# EAGLE design glass_udrive_pcb (EAGLE 7.7.0)
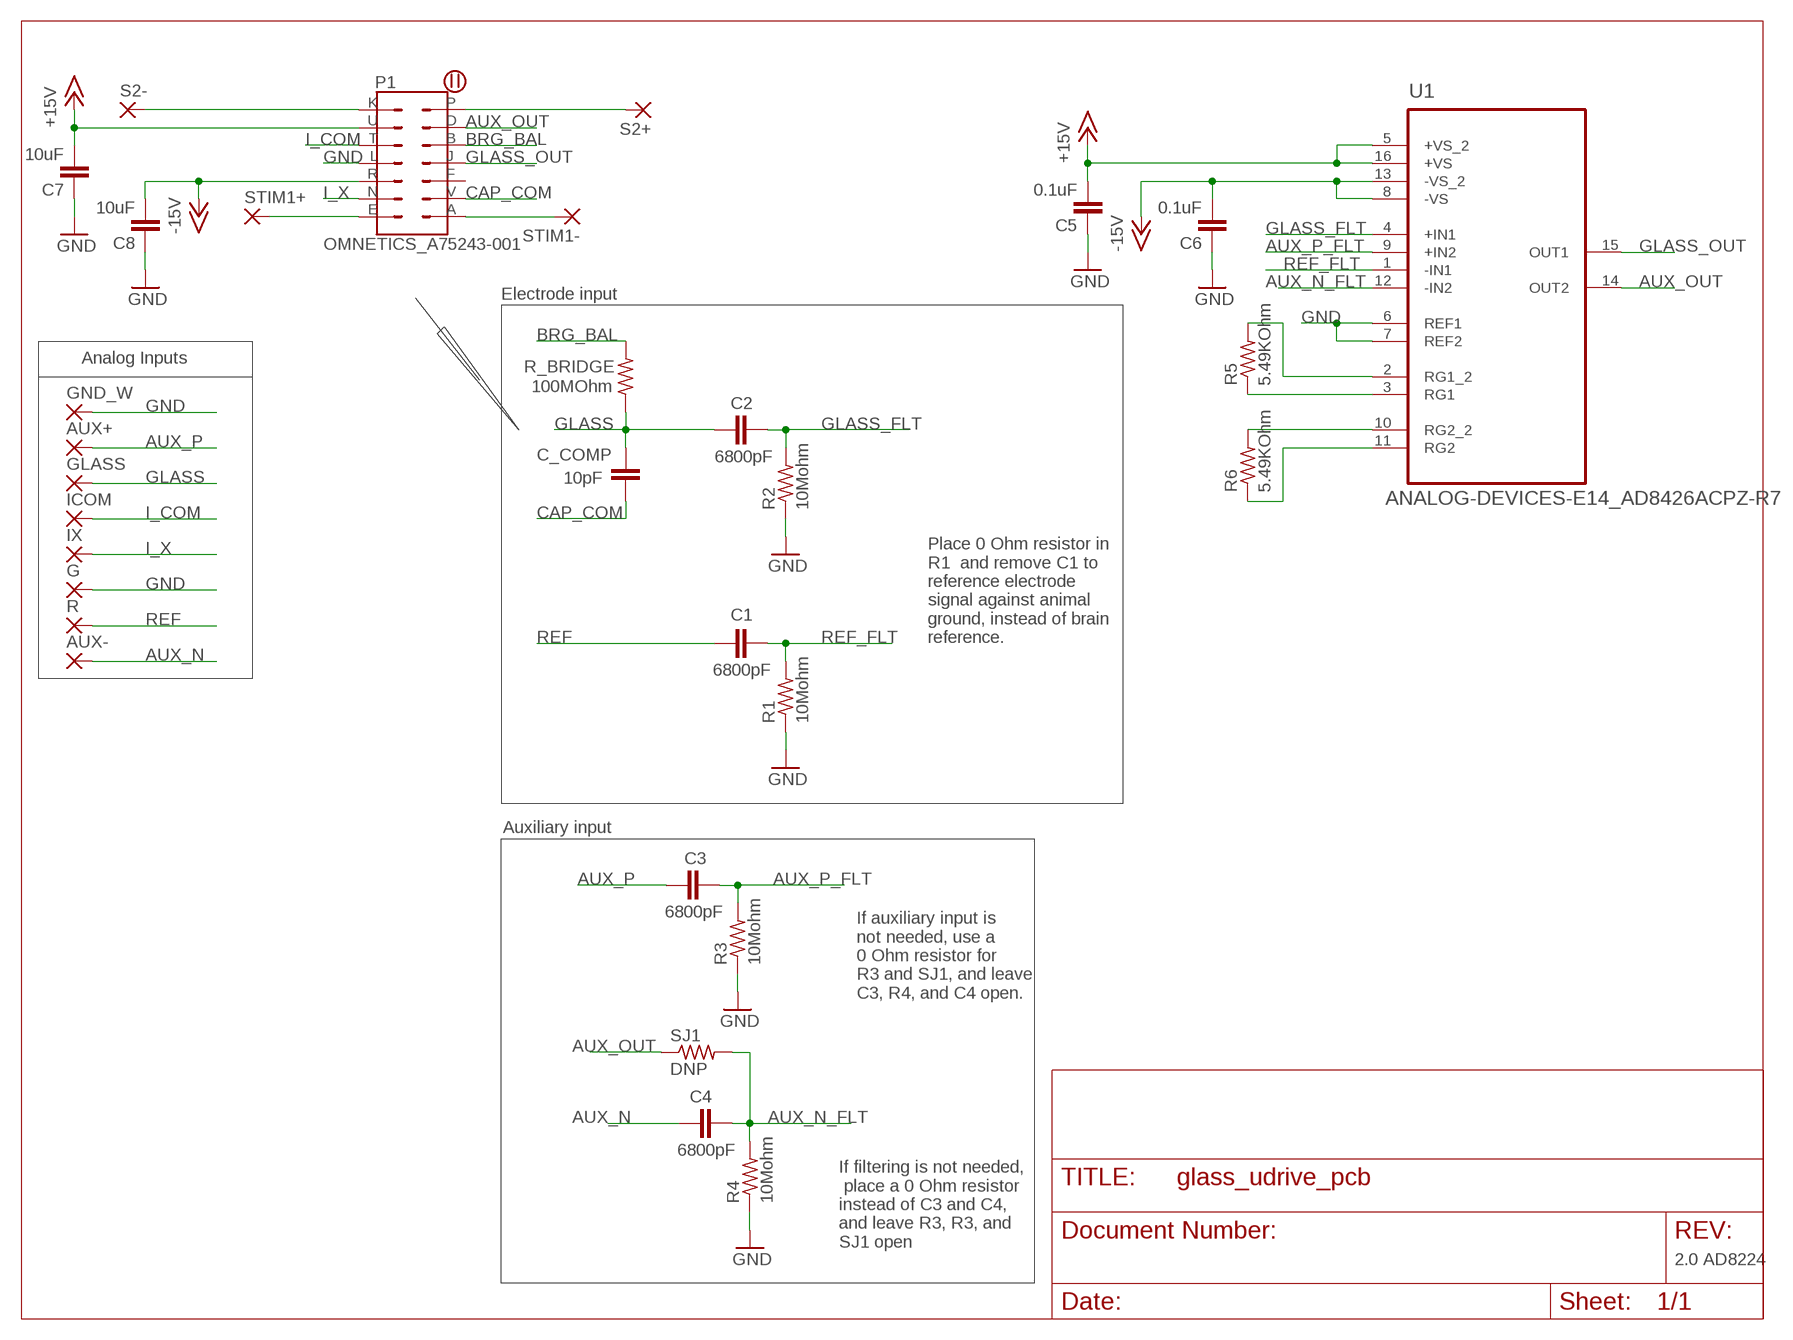
[diagram p0: schematic, sheet 1]

## Parts
AUX+  THROUGH-HOLE-30MIL/15MIL  [30MIL/15MIL]
AUX-  THROUGH-HOLE-30MIL/15MIL  [30MIL/15MIL]
C1  6800pF  C_0201  [0201]
C2  6800pF  C_0201  [0201]
C3  6800pF  C_0201  [0201]
C4  6800pF  C_0201  [0201]
C5  0.1uF  C_0201  [0201]
C6  0.1uF  C_0201  [0201]
C7  10uF  C_0603  [0603]
C8  10uF  C_0603  [0603]
C_COMP  10pF  C_0402  [0402]
G  THROUGH-HOLE-30MIL/15MIL  [30MIL/15MIL]
GLASS  THROUGH-HOLE-30MIL/15MIL  [30MIL/15MIL]
GND_W  THROUGH-HOLE-30MIL/15MIL  [30MIL/15MIL]
ICOM  THROUGH-HOLE-30MIL/15MIL  [30MIL/15MIL]
IX  THROUGH-HOLE-30MIL/15MIL  [30MIL/15MIL]
P1  OMNETICS_A75243-001  [OMNETICS_A75243-001]
R  THROUGH-HOLE-30MIL/15MIL  [30MIL/15MIL]
R1  10Mohm  R_0201  [0201]
R2  10Mohm  R_0201  [0201]
R3  10Mohm  R_0201  [0201]
R4  10Mohm  R_0201  [0201]
R5  5.49KOhm  R_0201  [0201]
R6  5.49KOhm  R_0201  [0201]
R_BRIDGE  100MOhm  R_0402  [0402]
S2+  THROUGH-HOLE-30MIL/15MIL  [30MIL/15MIL]
S2-  THROUGH-HOLE-30MIL/15MIL  [30MIL/15MIL]
SJ1  DNP  R_0201  [0201]
STIM1+  THROUGH-HOLE-30MIL/15MIL  [30MIL/15MIL]
STIM1-  THROUGH-HOLE-30MIL/15MIL  [30MIL/15MIL]
U1  ANALOG-DEVICES-E14_AD8426ACPZ-R7  [ANALOG-DEVICES-E14_QFN65P400X400X100-16N]

## Nets
+15V: C5.2 C7.2 P1.U U1.5(+VS_2) U1.16(+VS)
-15V: C6.2 C8.2 P1.R U1.8(-VS) U1.13(-VS_2)
AUX_N: AUX-.P$1(P) C4.1
AUX_N_FLT: C4.2 R4.2 SJ1.2 U1.12(-IN2)
AUX_OUT: P1.D SJ1.1 U1.14(OUT2)
AUX_P: AUX+.P$1(P) C3.1
AUX_P_FLT: C3.2 R3.2 U1.9(+IN2)
BRG_BAL: P1.B R_BRIDGE.2
CAP_COM: C_COMP.2 P1.V
GLASS: C2.1 C_COMP.1 GLASS.P$1(P) R_BRIDGE.1
GLASS_FLT: C2.2 R2.2 U1.4(+IN1)
GLASS_OUT: P1.J U1.15(OUT1)
GND: C5.1 C6.1 C7.1 C8.1 G.P$1(P) GND_W.P$1(P) P1.L R1.1 R2.1 R3.1 R4.1 U1.6(REF1) U1.7(REF2)
I_COM: ICOM.P$1(P) P1.T
I_X: IX.P$1(P) P1.N
N$2: R5.2 U1.2(RG1_2)
N$4: R5.1 U1.3(RG1)
N$6: R6.2 U1.10(RG2_2)
N$7: R6.1 U1.11(RG2)
REF: C1.1 R.P$1(P)
REF_FLT: C1.2 R1.2 U1.1(-IN1)
STIM1_N: P1.A STIM1-.P$1(P)
STIM1_P: P1.E STIM1+.P$1(P)
STIM2_N: P1.P S2+.P$1(P)
STIM2_P: P1.K S2-.P$1(P)
Unconnected: P1.F

## Notes on the sheet
- Electrode input
- Analog Inputs
- Place 0 Ohm resistor in 
  R1  and remove C1 to 
  reference electrode 
  signal against animal
  ground, instead of brain
  reference.
- Auxiliary input
- If auxiliary input is
  not needed, use a
  0 Ohm resistor for
  R3 and SJ1, and leave
  C3, R4, and C4 open.
- If filtering is not needed,
   place a 0 Ohm resistor 
  instead of C3 and C4, 
  and leave R3, R3, and 
  SJ1 open
- 2.0 AD8224

## Library data of the parts
AUX+ AUX- G GLASS GND_W ICOM IX R S2+ S2- STIM1+ STIM1- = GFL:THROUGH-HOLE-30MIL/15MIL: THROUGH-HOLE PAD
C1-C8 C_COMP = GFL:C: Capacitor
P1 = GFL:OMNETICS_A75243-001
R1-R6 R_BRIDGE SJ1 = GFL:R: Resistor
U1 = GyroDrive:ANALOG-DEVICES-E14_AD8426ACPZ-R7: Wide Supply Range, Rail-to-Rail Output Instrumentation Amplifier; MPN: AD8426ACPZ-R7; OC_FARNELL: 1971714; OC_NEWARK: 58T4523; PACKAGE: LFCSP-16; SUPPLIER: Analog Devices

## Board
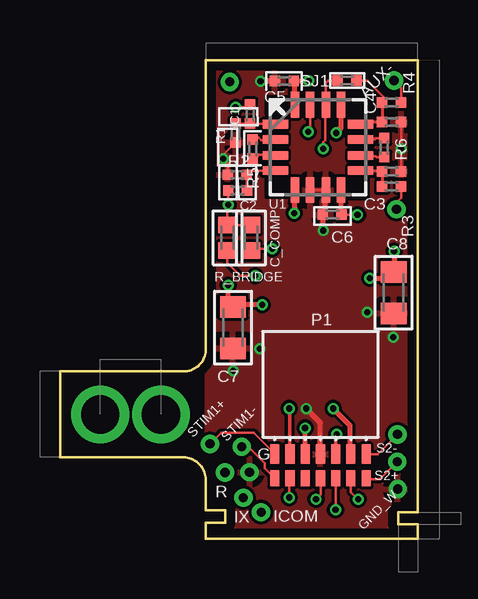
[diagram p1: board, top side]
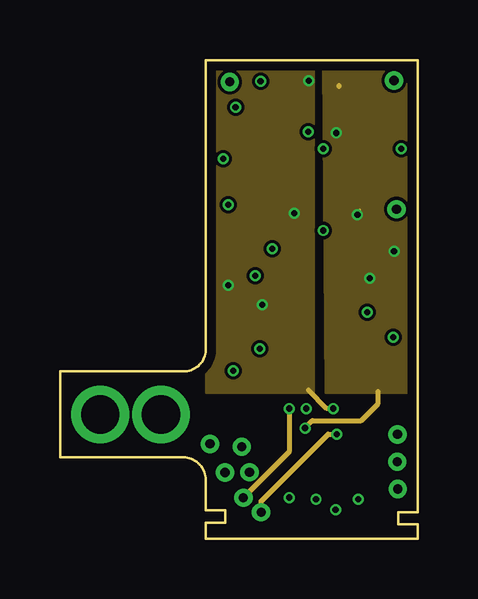
[diagram p2: board, inner layer Route2]
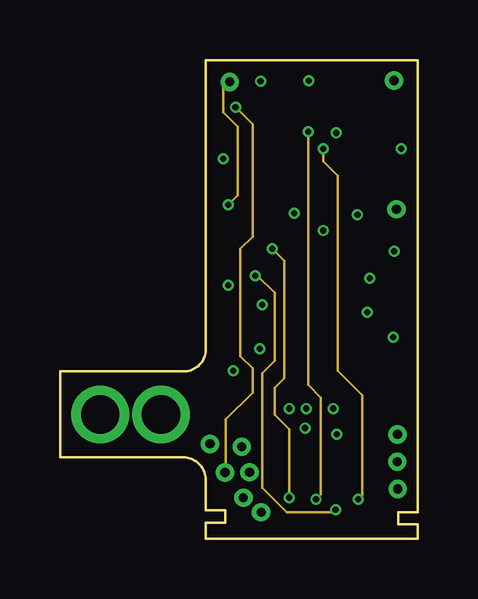
[diagram p3: board, inner layer Route15]
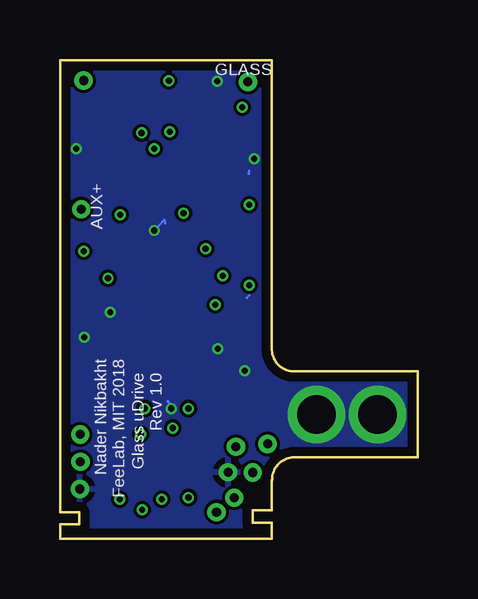
[diagram p4: board, bottom side, seen from below]

Size 14.9 x 19.95 mm. Coordinates in mm from the lower left corner, seen from the top.
Outline: 14.9,8.14 14.9,19.95 6.09,19.95
Outline: 6.07,0.68 6.07,0 14.9,0 14.9,0.6
Outline: 14.9,1.1 14.9,8.17
Outline: 6.07,2.46 arc90 5.13,3.4 0,3.4 0,6.98 5.13,6.98 arc90 6.07,7.86 6.07,19.95
Outline: 6.07,2.46 6.07,1.2
Outline: 6.08,1.2 6.88,1.2 6.88,0.68 6.08,0.68
Outline: 14.9,0.6 14.1,0.6 14.1,1.1 14.9,1.1
Copper layers (1*2*15*16): Top 0.035559375mm / dielectric 0.17018125mm / Route2 0.01778125mm / dielectric 47mil / Route15 0.01778125mm / dielectric 0.17018125mm / Bottom 0.035559375mm
Design rules "pcbway *": minimum track width 4mil, minimum drill 10mil, track to track 5mil, track to pad 5mil, pad to pad 5mil, via to via 5mil, smd to smd 5mil, copper to edge 15mil, drill to drill 6mil, minimum pad ring 4mil, minimum via ring 4mil, stop-mask expansion 2.5mil, vias tented up to drill 12mil, thermal gap 10mil
tRestrict: area 8.5,17.6 to 9.5,18.5; area 12,17.6 to 12.9,18.5; area 12,14.1 to 12.9,15; area 8.5,14.2 to 9.5,15

### Footprints (pad centres in the part's own frame; a part is rotated, then mirrored left to right if it is on the bottom)
30MIL/15MIL = drill 0.381 pad 0.762: P$1 0,0
0201 = smd 0.432 x 0.432: 1 -0.394,0; 2 0.394,0
0603 = smd 0.889 x 1.067: 1 -0.864,0; 2 0.864,0
0402 = smd 0.686 x 0.762: 1 -0.533,0; 2 0.533,0
OMNETICS_A75243-001 = smd 0.381 x 0.686: A -1.905,-0.47; B 0.635,-0.47; D 1.27,-0.47; F -0.635,-0.47; J 0,-0.47; P 1.905,-0.47; V -1.27,-0.47 | smd 0.381 x 0.813: E -1.905,0.533; K 1.905,0.533; L 0,0.533; N -1.27,0.533; R -0.635,0.533; T 0.635,0.533; U 1.27,0.533
ANALOG-DEVICES-E14_QFN65P400X400X100-16N = smd 1.067 x 0.356: 1 -1.778,0.965; 2 -1.778,0.33; 3 -1.778,-0.33; 4 -1.778,-0.965; 9 1.778,-0.965; 10 1.778,-0.33; 11 1.778,0.33; 12 1.778,0.965 | smd 0.356 x 1.067: 5 -0.965,-1.778; 6 -0.33,-1.778; 7 0.33,-1.778; 8 0.965,-1.778; 13 0.965,1.778; 14 0.33,1.778; 15 -0.33,1.778; 16 -0.965,1.778

### Placement (x,y rotation side)
AUX+  14.02,13.74 0 top
AUX-  13.92,19.1 0 top
C1  7.92,17.7 270 top
C2  7.41,14.51 0 top
C3  13.82,14.68 180 top
C4  13.82,18.18 180 top
C5  9.34,19.08 0 top
C6  11.34,13.51 0 top
C7  7.21,8.8 90 top
C8  13.9,10.26 90 top
C_COMP  7.96,12.54 270 top
G  7.9,2.77 0 top
GLASS  7.07,19.04 0 top
GND_W  14.07,2.08 0 top
ICOM  8.38,1.11 0 top
IX  7.64,1.71 0 top
P1  10.85,3 0 top
R  6.87,2.77 0 top
R1  7.31,16.91 90 top
R2  7.38,15.17 0 top
R3  13.82,15.31 180 top
R4  13.82,17.37 180 top
R5  8.03,16.25 90 top
R6  13.51,16.3 270 top
R_BRIDGE  6.98,12.54 270 top
S2+  14.05,3.21 0 top
S2-  14.06,4.35 0 top
SJ1  11.96,19.1 0 top
STIM1+  6.25,3.96 0 top
STIM1-  7.57,3.84 0 top
U1  10.75,16.31 0 top

### Tracks (layer width: path | path; a pad name or v marks a point on that pad's centre or on a via)
+15V  (via drill 0.25)
  Top 0.203: P1.U 12.09,3.56 12.09,4.72 v11.38,5.43 | v9.76,13.56 9.78,13.79 U1.5 | C7.2 7.01,9.86 v7.01,10.56 | v10.36,19.1 10.35,19.08 C5.2 9.78,19.04 U1.16 | v8.43,9.75 7.21,9.75
  Route2 0.203: v11.38,5.43 11.12,5.43 10.36,6.19 | v10.36,19.1 10.46,19.1
  pour Route2: 6.1,19.91 10.57,19.91 10.57,6.09 6.1,6.09
-15V  (via drill 0.25)
  Top 0.102: v12.39,13.51 C6.2 11.71,13.53 | C8.2 13.65,10.87
  Top 0.127: 11.73,14.51 U1.8
  Top 0.203: P1.R v10.21,4.62 | U1.13 11.71,17.12 v11.51,16.91 | v12.9,10.87 13.65,10.87 | 11.71,13.53 U1.8 | v13.92,11.98 13.92,11.07
  Route2 0.102: v12.39,13.51 12.39,13.61 12.5,13.71
  Route2 0.203: 13.26,6.14 13.26,5.63 12.55,4.92 10.52,4.92 v10.21,4.62 | 11.63,18.84 11.63,18.89
  pour Route2: 10.97,19.91 14.83,19.91 14.93,6.09 11.07,6.09
AUX_N
  Top 0.102: C4.1 14.21,18.8 AUX-.P$1
AUX_N_FLT
  Top 0.102: C4.2 13.47,18.42 12.8,19.1 SJ1.2
  Top 0.127: C4.2 R4.2 12.62,17.37 U1.12
AUX_OUT  (via drill 0.25)
  Top 0.102: P1.D 12.12,1.95 v12.42,1.65 | v10.97,16.25 10.97,16.53 11.05,16.61 11.05,18.06 U1.14 | SJ1.1 11.18,19.1 11.07,19 U1.14 | U1.14
  Route15 0.102: v10.97,16.25 10.97,15.74 11.58,15.13 11.58,7.01 12.6,5.99 12.6,1.82 v12.42,1.65
AUX_P
  Top 0.102: 14.22,14.69 14.22,14.22 14.02,14.02 AUX+.P$1 | 14.22,14.74 14.22,14.69 | 14.22,14.69 C3.1
AUX_P_FLT
  Top 0.102: U1.9 13.11,15.35 | 13.44,15.35 13.11,15.35 | R3.2 13.14,15.31 13.11,15.35
  Top 0.127: R3.2 C3.2
BRG_BAL  (via drill 0.25)
  Top 0.102: v11.48,1.22 P1.B | R_BRIDGE.2 6.98,11.51 7.52,10.97 v8.13,10.97
  Route15 0.102: v11.48,1.22 11.38,1.11 9.45,1.11 8.43,2.13 8.43,6.9 8.94,7.41 8.94,10.26 8.23,10.97 v8.13,10.97
CAP_COM  (via drill 0.25)
  Top 0.102: v9.55,1.72 9.55,2.49 P1.V | v8.84,12.09 7.96,12.09 C_COMP.2
  Route15 0.102: v9.55,1.72 9.55,4.57 8.94,5.18 8.94,6.3 9.35,6.7 9.35,11.58 v8.84,12.09
GLASS  (via drill 0.25)
  Top 0.102: R_BRIDGE.1 6.98,12.87 | C2.1 v7.01,13.92 6.98,13.92 R_BRIDGE.1 | C_COMP.1 R_BRIDGE.1
  Route15 0.102: GLASS.P$1 6.81,18.77 6.81,17.78 7.42,17.17 7.42,14.32 v7.01,13.92
GLASS_FLT
  Top 0.102: C2.2 7.78,14.54 R2.2 7.95,15.35 U1.4
GLASS_OUT  (via drill 0.25)
  Top 0.102: 10.87,2.33 10.87,2.51 | P1.J 10.85,2.35 10.87,2.33 | 10.87,2.33 10.87,1.85 v10.67,1.65 | U1.15 10.42,17.05 v10.34,16.96
  Route15 0.102: v10.34,16.96 10.34,6.42 10.87,5.89 10.87,1.85 v10.67,1.65
GND  (via drill 0.25, 1.6)
  Top 0.102: 10.95,13.41 C6.1 | R3.1 14.22,15.35 v14.22,16.25 14.22,17.33 R4.1 | R2.1 6.99,15.66 v6.81,15.85 6.81,16.01 R1.1
  Top 0.127: C6.1 10.9,13.46 10.87,13.46 10.82,13.41 | U1.7 U1.6
  Top 0.152: U1.7
  Top 0.203: C8.1 14.02,9.38 13.75,9.65 | C5.1 8.94,19.07 v8.36,19.07 | U1.7 11.05,14.5 11.05,13.61 C6.1 10.97,13.51 v10.97,12.85 | P1.L 10.85,4.84 v10.26,5.43 | C7.1 6.91,7.64
  Bottom 0.102: 7.03,15.21 7.01,15.34 | v10.97,12.85 10.57,13.31 10.52,13.15 | v10.26,5.43 10.36,5.69 10.41,5.74 | 7.01,10.16 7.11,10.05
  other vias: 1.68,5.18 4.22,5.18 12.8,9.44 7.21,7.01 8.33,7.92 13.89,8.4
  pour Bottom: 6.07,20.04 14.89,20 14.88,6.14 14.91,5.15 14.88,3.65 14.83,0 6.04,0 6.1,2.99 5.43,3.58 0.08,3.53 -0.03,6.63 0.05,7.01 6.07,7.03
  pour Top: 6.07,19.96 14.91,19.96 14.91,0 6.07,0
I_COM  (via drill 0.25)
  Top 0.152: P1.T 11.49,4.32 v11.53,4.36
  Route2 0.203: ICOM.P$1 8.38,1.57 11.18,4.36 v11.53,4.36
I_X  (via drill 0.25)
  Top 0.102: 9.58,5.4 v9.55,5.43
  Top 0.152: P1.N 9.58,5.4
  Route2 0.203: v9.55,5.43 9.55,3.62 IX.P$1
N$2
  Top 0.102: R5.2 8.27,16.72 8.38,16.61 8.94,16.61 U1.2
N$4
  Top 0.102: R5.1 8.21,15.93 8.28,16 8.95,16 U1.3
N$6
  Top 0.102: R6.2 13.19,15.91 13.16,15.95 12.56,15.95 U1.10
N$7
  Top 0.102: R6.1 13.14,16.7 13.11,16.66 12.54,16.66 U1.11
REF  (via drill 0.25)
  Top 0.102: v7.31,17.98 7.92,17.98 8.03,18.08 8.01,18.09 C1.1
  Route15 0.102: R.P$1 6.91,2.8 6.91,4.97 8.03,6.09 8.03,7.11 7.52,7.62 7.52,12.09 8.03,12.59 8.03,17.27 v7.31,17.98
REF_FLT
  Top 0.102: R1.2 C1.2 8.94,17.31 U1.1
STIM1_N
  Top 0.102: P1.A 8.53,2.94 8.53,3.15 7.84,3.84 STIM1-.P$1
STIM1_P
  Top 0.102: STIM1+.P$1 6.71,4.42 8.08,4.42 8.95,3.55 P1.E
STIM2_N
  Top 0.102: 12.76,2.48 13.32,2.48 S2+.P$1
  Top 0.127: P1.P 12.76,2.48
STIM2_P
  Top 0.102: 12.86,3.53 13.24,3.53 S2-.P$1
  Top 0.127: P1.K 12.86,3.53

### Text on the board
bPlace: Nader Nikbakht / FeeLab, MIT 2018 | Glass uDrive / Rev 1.0
tDocu: anchoring tab